# EAGLE design st-tag-adapter (EAGLE 7.3.0)
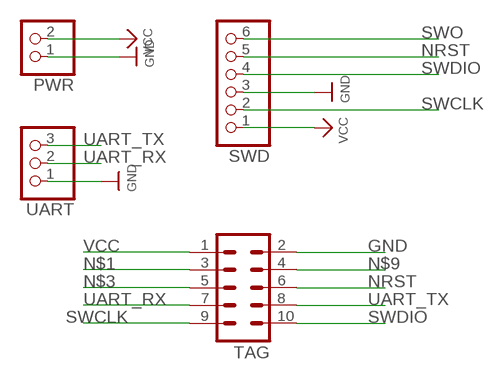
[diagram p0: schematic, sheet 1]

## Parts
PWR  HEADER-1X2ROUND  [1X02_ROUND]
SWD  HEADER-1X6ROUND  [1X06_ROUND]
TAG  ML10  [ML10]
UART  HEADER-1X3ROUND  [1X03_ROUND]

## Nets
GND: PWR.1 SWD.3 TAG.2 UART.1
N$1: TAG.3
N$3: TAG.5
N$9: TAG.4
NRST: SWD.5 TAG.6
SWCLK: SWD.2 TAG.9
SWDIO: SWD.4 TAG.10
SWO: SWD.6
UART_RX: TAG.7 UART.2
UART_TX: TAG.8 UART.3
VCC: PWR.2 SWD.1 TAG.1

## Library data of the parts
PWR = microbuilder:HEADER-1X2: PIN HEADER
SWD = microbuilder:HEADER-1X6: PIN HEADER
TAG = con-harting-ml:ML10: HARTING; OC_FARNELL: unknown; OC_NEWARK: unknown
UART = microbuilder:HEADER-1X3: PIN HEADER

## Board
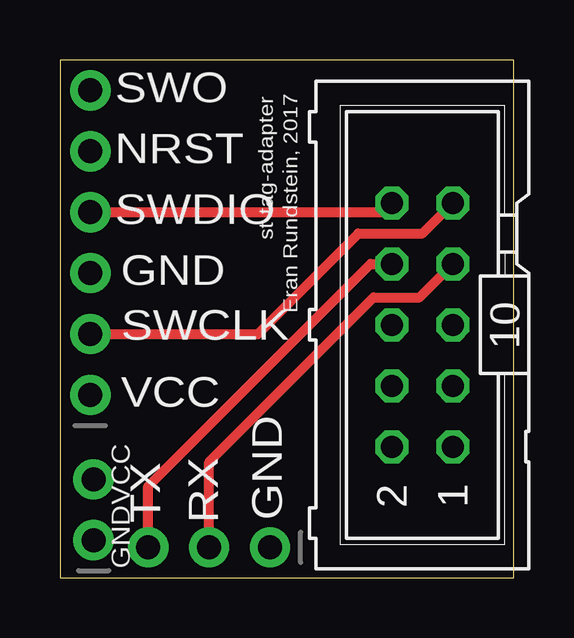
[diagram p1: board, top side]
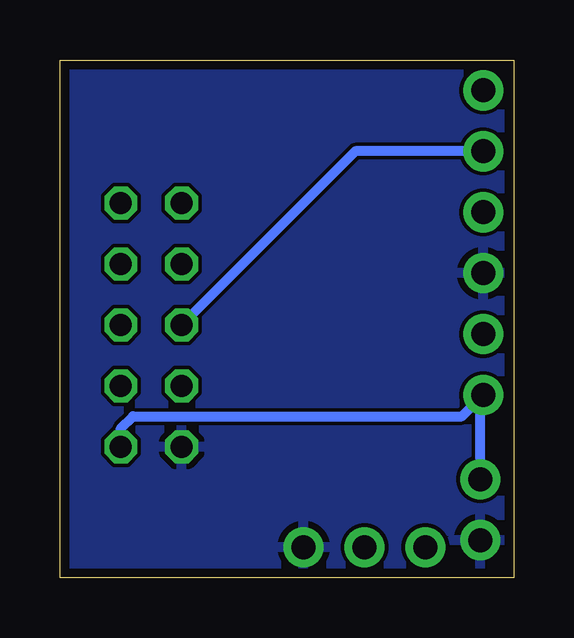
[diagram p2: board, bottom side, seen from below]

Size 18.92 x 21.59 mm. Coordinates in mm from the lower left corner, seen from the top.
Outline: 0,0 18.92,0 18.92,21.59 0,21.59 0,0
Copper layers (1*16): Top 0.0356mm / dielectric 1.5011mm / Bottom 0.0356mm
Design rules "oshpark *": minimum track width 6mil, minimum drill 13mil, track to track 6mil, track to pad 6mil, pad to pad 6mil, via to via 6mil, smd to smd 6mil, copper to edge 15mil, drill to drill 6mil, minimum pad ring 7mil, minimum via ring 7mil, stop-mask expansion 3mil, vias tented up to drill 0mil, thermal gap 10mil

### Footprints (pad centres in the part's own frame; a part is rotated, then mirrored left to right if it is on the bottom)
1X02_ROUND = drill 1 pad 1.676: 1 -1.27,0; 2 1.27,0
1X06_ROUND = drill 1 pad 1.676: 1 -6.35,0; 2 -3.81,0; 3 -1.27,0; 4 1.27,0; 5 3.81,0; 6 6.35,0
ML10 = drill 0.914 octagon: 1 -5.08,-1.27; 2 -5.08,1.27; 3 -2.54,-1.27; 4 -2.54,1.27; 5 0,-1.27; 6 0,1.27; 7 2.54,-1.27; 8 2.54,1.27; 9 5.08,-1.27; 10 5.08,1.27
1X03_ROUND = drill 1 pad 1.676: 1 -2.54,0; 2 0,0; 3 2.54,0

### Placement (x,y rotation side)
PWR  1.4,2.83 90 top
SWD  1.27,13.97 90 top
TAG  15.11,10.54 90 top
UART  6.22,1.27 180 top

### Tracks (layer width: path | path; a pad name or v marks a point on that pad's centre or on a via)
GND
  pour Bottom: -0.76,22.35 20.95,22.35 20.95,-1.78 -1.02,-1.78 -1.02,22.1
NRST
  Bottom 0.406: SWD.5 6.6,17.78 TAG.6
SWCLK
  Top 0.406: SWD.2 8.26,10.16 12.45,14.35 15.11,14.35 TAG.9
SWDIO
  Top 0.406: SWD.4 13.46,15.24 TAG.10
UART_RX
  Top 0.406: UART.2 6.22,4.83 13.08,11.68 14.99,11.68 TAG.7
UART_TX
  Top 0.406: UART.3 3.68,3.81 12.95,13.08 TAG.8
VCC
  Bottom 0.406: TAG.1 16.38,6.22 15.88,6.73 2.16,6.73 SWD.1 1.4,7.49 PWR.2

### Text on the board
tPlace: st-tag-adapter | Eran Rundstein, 2017
tNames: SWO | NRST | SWDIO | GND | SWCLK | VCC | VCC | TX | RX | GND | GND